# Altium project 2011_BatteryMaster.PrjPcb
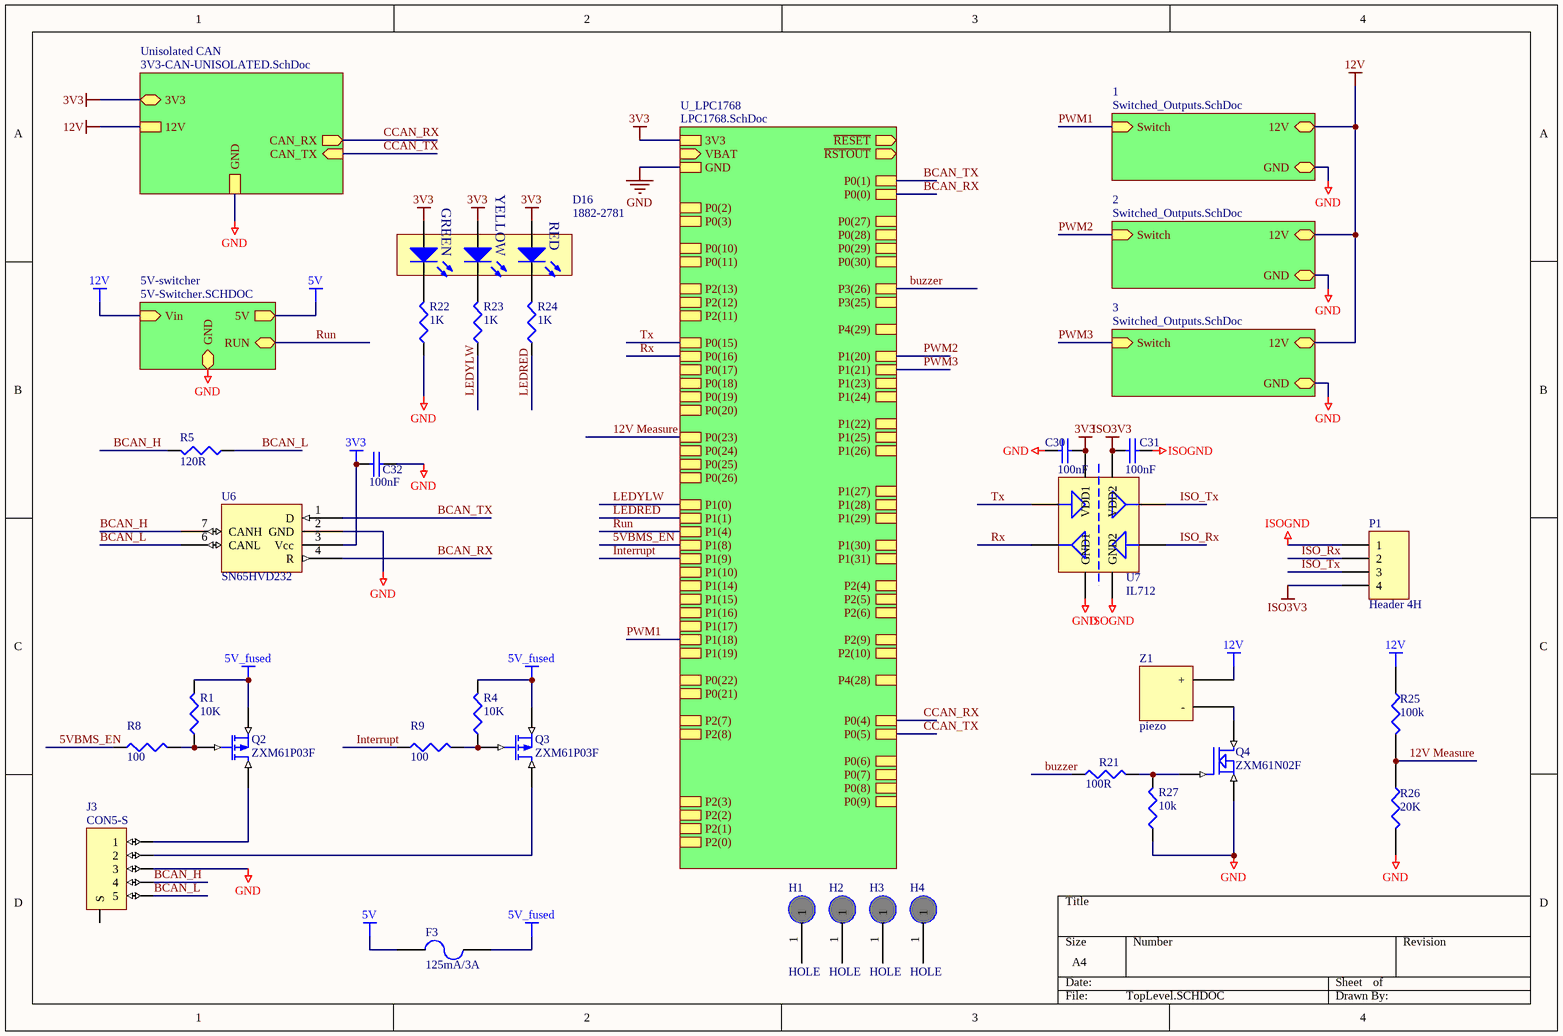
[diagram p0: TopLevel.SCHDOC]
5 sheets, 76 parts. Net scope: hierarchical (ports join the sheet entries above them; power ports are global).
Board files: BMSFaceplate.PcbDoc, CANFaceplate.PcbDoc, BatteryMaster.PcbDoc
Sheets:
  TopLevel.SCHDOC
    Unisolated CAN = 3V3-CAN-UNISOLATED.SchDoc
      U_3V-Switcher-50mA = 3V-Switcher-50mA.SCHDOC
    1 = Switched_Outputs.SchDoc
    2 = Switched_Outputs.SchDoc
    3 = Switched_Outputs.SchDoc
    5V-switcher = 5V-Switcher.SchDoc

## Sheet TopLevel.SCHDOC
size A4

### Parts
C30  100nF  [0603]
C31  100nF  [0603]
C32  100nF  [0603]
D16  1882-2781  [LED_TRILEVEL]
F3  125mA/3A  [LITTELFUSE-154]
H1  HOLE  [M2.5]
H2  HOLE  [M2.5]
H3  HOLE  [M2.5]
H4  HOLE  [M2.5]
J3  CON5-S  [TRIAD5F]
P1  Header 4H  [HDR1X4H]
Q2  ZXM61P03F  [SOT23-3]
Q3  ZXM61P03F  [SOT23-3]
Q4  ZXM61N02F  [SOT23-3]
R1  10K  [0603]
R4  10K  [0603]
R5  120R  [0603]
R8  100  [0603]
R9  100  [0603]
R21  100R  [0603]
R22  1K  [0603]
R23  1K  [0603]
R24  1K  [0603]
R25  100k  [1206]
R26  20K  [1206]
R27  10k  [0603]
U6  SN65HVD232  [SO8]
U7  IL712  [SO8]
Z1  piezo  [piezo]

### Sub-sheets
1 = Switched_Outputs.SchDoc: Switch (in), 12V, GND
2 = Switched_Outputs.SchDoc: Switch (in), 12V, GND
3 = Switched_Outputs.SchDoc: Switch (in), 12V, GND
5V-switcher = 5V-Switcher.SCHDOC: GND, 5V, Vin, RUN
U_LPC1768 = LPC1768.SchDoc (file not in this document): P0(26), P0(25), P0(24), P0(23), P1(31), P1(30), P0(28), P0(27), P3(26), P3(25), P0(29), P0(30), P1(18), P1(19), P1(20), P1(21), P1(22), P1(24), P1(23), P1(25), P1(26), P1(27), P1(28), P1(29), P0(0), P0(1), P0(10), P0(11), P2(13), P2(12), P2(11), P2(10), P0(22), P0(21), P0(20), P0(19), P0(18), P0(17), P0(15), P0(16), P2(9), P2(8), P2(7), P2(6), P2(5), P2(4), P2(3), P2(2), P2(1), P2(0), P0(2), P0(3), P1(0), P1(1), P1(4), P1(8), P1(9), P1(10), P1(14), P1(15), P1(16), P1(17), P0(4), P0(5), P0(6), P0(7), P0(8), P0(9), P4(29), P4(28), GND, 3V3, ~{RSTOUT}, ~{RESET}, VBAT (in)
Unisolated CAN = 3V3-CAN-UNISOLATED.SchDoc: 12V, GND, 3V3, CAN_RX (out), CAN_TX (in)

### Nets
3V3: C30.2 C32.2 D16.4(A) D16.5(A) D16.6(A) U6.3(Vcc) U7.1(VDD1) ; sheet Unisolated CAN/3V3, sheet U_LPC1768/3V3
5V: F3.2 ; sheet 5V-switcher/5V
5V_fused: F3.1 Q2.2(D) Q3.2(D) R1.2 R4.2
12V: R25.1 Z1.1(+) ; sheet Unisolated CAN/12V, sheet 1/12V, sheet 2/12V, sheet 3/12V, sheet 5V-switcher/Vin
GND: C30.1 C32.1 J3.3 Q4.2(S) R22.1 R26.2 R27.1 U6.2(GND) U7.4(GND1) ; sheet Unisolated CAN/GND, sheet 1/GND, sheet 2/GND, sheet U_LPC1768/GND, sheet 3/GND, sheet 5V-switcher/GND  [project net CANGND]
ISO3V3: C31.1 P1.4 U7.8(VDD2)
ISOGND: C31.2 P1.1 U7.5(GND2)
5VBMS_EN: R8.1 ; sheet U_LPC1768/P1(8)
12V Measure: R25.2 R26.1 ; sheet U_LPC1768/P0(23)
BCAN_H: J3.4 R5.2 U6.7(CANH)
BCAN_L: J3.5 R5.1 U6.6(CANL)
BCAN_RX: U6.4(R) ; sheet U_LPC1768/P0(0)
BCAN_TX: U6.1(D) ; sheet U_LPC1768/P0(1)
buzzer: R21.1 ; sheet U_LPC1768/P3(26)
CCAN_RX: sheet Unisolated CAN/CAN_RX, sheet U_LPC1768/P0(4)
CCAN_TX: sheet Unisolated CAN/CAN_TX, sheet U_LPC1768/P0(5)
Interrupt: R9.1 ; sheet U_LPC1768/P1(9)
ISO_Rx: P1.2 U7.6(IN2)
ISO_Tx: P1.3 U7.7(OUT1)
LEDRED: R24.1 ; sheet U_LPC1768/P1(1)
LEDYLW: R23.1 ; sheet U_LPC1768/P1(0)
PWM1: sheet 1/Switch, sheet U_LPC1768/P1(18)
PWM2: sheet 2/Switch, sheet U_LPC1768/P1(20)
PWM3: sheet U_LPC1768/P1(21), sheet 3/Switch
Run: sheet U_LPC1768/P1(4), sheet 5V-switcher/RUN
Rx: U7.3(OUT2) ; sheet U_LPC1768/P0(16)
Tx: U7.2(IN1) ; sheet U_LPC1768/P0(15)
NetD16_1: D16.1(K) R22.2
NetD16_2: D16.2(K) R23.2
NetD16_3: D16.3(K) R24.2
NetJ3_1: J3.1 Q2.3(S)
NetJ3_2: J3.2 Q3.3(S)
NetQ2_1: Q2.1(G) R1.1 R8.2
NetQ3_1: Q3.1(G) R4.1 R9.2
NetQ4_1: Q4.1(G) R21.2 R27.2
NetQ4_3: Q4.3(D) Z1.2(-)

Not connected (* = marked no-connect by the designer): H1 1; H2 1; H3 1; H4 1; J3 0(S)

### Library data of the parts
C30-C32 = CAP: Capacitor; Farnell: 753-567; Price: 0.31
D16 = LED-TRILEVEL: Three level LED; Element14 (low stock): 1461596; Element14 Price: 4.56; Digikey: 350-1751-ND; Digikey Price: 2.84
F3 = FUSE2: Fuse; Farnell: 664-893; Other Info: www.littelfuse.com; Price: 5.67
J3 = CON5-S: Connector, 2 pin, with shield @ S; Farnell: .131-040; Price: 19.32
P1 = Header 4H: Header, 4-Pin, Right Angle; LatestRevisionDate: 17-Jul-2002; LatestRevisionNote: Re-released for DXP Platform.; Publisher: Altium Limited
Q2 Q3 = ZXM61P03F: 1.1A, 30V P-Channel Enhancement mode FET; Order#: 9525300; Price: 0.825; Supplier: Farnell
Q4 = ZXM61N02F: 1.7A, 20V N-Channel Enhancement mode FET; Farnell: 325-6194; Price: 0.75
R1 R4 R5 R8 R9 R22-R24 = RES1: Resistor; Farnell: *
R21 R25-R27 = RES1
  R21 R27: Farnell: 911-112; Price: 0.119
  R25: Farnell: 308-6422; Price: 1.010
  R26: Farnell: 308-6252; Price: 1.010
U6 = SN65HVD232: 3.3V CAN Transciever; Farnell: NA
U7 = IL712: IL712 Optical Isolator; Element14 (low stock): 9570608; Element14 Price: 9.40; Digikey: 390-1061-5-ND; Digikey Price: 5.86

## Sheet 3V3-CAN-UNISOLATED.SchDoc
size A4; Organization: UNSW Solar Racing Team; Address3: UNSW; Address4: Sydney NSW 2052; Address2: Electrical Engineering; Address1: Rm 109
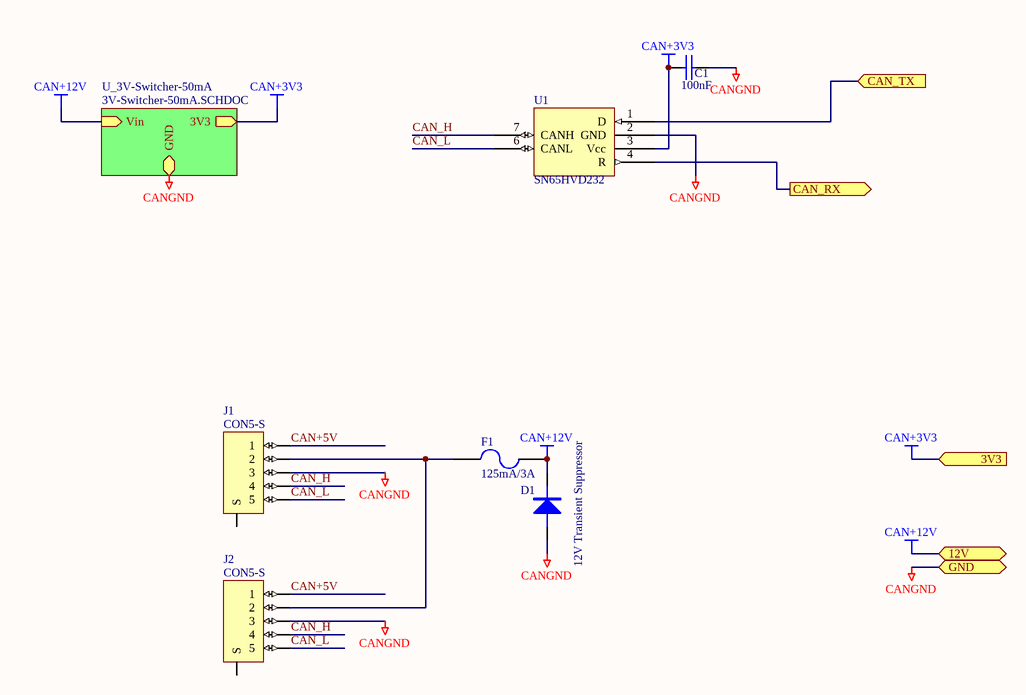
[diagram p1: 3V3-CAN-UNISOLATED.SchDoc]

### Parts
C1  100nF  [0603]
D1  12V Transient Suppressor  [SMA]
F1  125mA/3A  [LITTELFUSE-154]
J1  CON5-S  [TRIAD5F]
J2  CON5-S  [TRIAD5F]
U1  SN65HVD232  [SO8]

### Sub-sheets
U_3V-Switcher-50mA = 3V-Switcher-50mA.SCHDOC: GND, 3V3, Vin

### Ports
3V3, 12V, CAN_RX (out), CAN_TX (in), GND

### Nets
CAN+3V3: C1.2 U1.3(Vcc) ; port 3V3, sheet U_3V-Switcher-50mA/3V3  [project net 3V3]
CAN+12V: D1.K F1.2 ; port 12V, sheet U_3V-Switcher-50mA/Vin  [project net 12V]
CANGND: C1.1 D1.A J1.3 J2.3 U1.2(GND) ; port GND, sheet U_3V-Switcher-50mA/GND
CAN+5V: J1.1 J2.1
CAN_H: J1.4 J2.4 U1.7(CANH)
CAN_L: J1.5 J2.5 U1.6(CANL)
CCAN_RX: U1.4(R) ; port CAN_RX
CCAN_TX: U1.1(D) ; port CAN_TX
NetF1_1: F1.1 J1.2 J2.2

Not connected (* = marked no-connect by the designer): J1 0(S); J2 0(S)

### Notes on the sheet
- Title
- Size:
- Date:
- A4
- Number:
- Time:
- Revision:
- Sheet
- of
- File:

### Library data of the parts
C1 = CAP: Capacitor; Farnell: 753-567; Price: 0.31
D1 = DIODE: Farnell: 302-3096; Price: 1.25
F1 = FUSE2: Fuse; Farnell: 664-893; Other Info: www.littelfuse.com; Price: 5.67
J1 J2 = CON5-S: Connector, 2 pin, with shield @ S; Farnell: .131-040; Price: 19.32
U1 = SN65HVD232: 3.3V CAN Transciever; Farnell: NA

## Sheet 3V-Switcher-50mA.SCHDOC
size A4; Organization: UNSW Solar Racing Team; Address3: UNSW; Address4: Sydney NSW 2052; Address2: Electrical Engineering; Address1: Rm 109
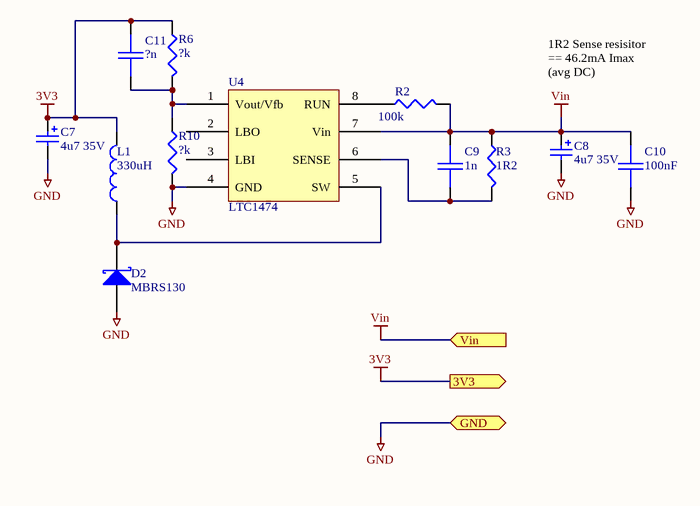
[diagram p2: 3V-Switcher-50mA.SCHDOC]

### Parts
C7  4u7 35V  [MCCT-CASEC]
C8  4u7 35V  [MCCT-CASEC]
C9  1n  [0603]
C10  100nF  [0603]
C11  ?n  [0603]
D2  MBRS130  [SMB]
L1  330uH  [1812]
R2  100k  [0603]
R3  1R2  [0603]
R6  value ?k  [0603]  (hidden comment: 100k)
R10  value ?k  [0603]  (hidden comment: 100k)
U4  LTC1474  [SO8]

### Ports
3V3, GND, Vin (in)

### Nets
3V3: C7.1 C11.1 L1.2 R6.1 ; port 3V3
GND: C7.2 C8.2 C10.2 D2.A R10.2 U4.4(GND) ; port GND  [project net CANGND]
Vin: C8.1 C9.1 C10.1 R2.2 R3.1 U4.7(Vin) ; port Vin  [project net 12V]
NetC9_2: C9.2 R3.2 U4.6(SENSE)
NetC11_2: C11.2 R6.2 R10.1 U4.1(Vout/Vfb)
NetD2_K: D2.K L1.1 U4.5(SW)
NetR2_1: R2.1 U4.8(RUN)

Not connected (* = marked no-connect by the designer): U4 2(LBO) 3(LBI)

### Notes on the sheet
- 1R2 Sense resisitor == 46.2mA Imax (avg DC)
- Title
- Size:
- Date:
- A4
- Number:
- Time:
- Revision:
- Sheet
- of
- File:

### Library data of the parts
C7 C8 = Cap Pol3: Polarized Capacitor (Surface Mount); Value: 4.7uF; Revision: July-2002: Re-released for DXP Platform.; Farnell: 967-294; Price: 1.97
C9 C11 = CAP: Capacitor; Value: 1nF; Revision: July-2002: Re-released for DXP Platform.; Farnell: 317-202; Price: 0.15
C10 = CAP: Capacitor; Value: 0.1uF; Revision: July-2002: Re-released for DXP Platform.; Farnell: 753-567; Price: 0.31
D2 = D SCHOTTKY: Schottky Diode; Revision: July-2002: Re-released for DXP Platform.; Farnell: 708-150; Price: 1.49
L1 = Inductor: Revision: July-2002: Re-released for DXP Platform.; Value: 330uH; Farnell: 200-451; Price: 2.90
R2 R6 R10 = RES1: Resistor; Farnell: 612-728; Price: 0.13
  R2: Value: 100k
R3 = RES1: Resistor; Value: 1.2R; Revision: July-2002: Re-released for DXP Platform.; Farnell: 360-2229; Price: 0.15
U4 = LTC1474: Step-down converter; Farnell: NA

## Sheet Switched_Outputs.SchDoc: 4 Port Switch Card Top Level
size A4; Date: June 2003; CheckedBy: Bonne Eggleston; Author: Johanna May; Organization: UNSW Solar Racing Team; Address3: UNSW; Address4: Sydney NSW 2052; SheetNumber: 1; SheetTotal: 2; Address2: Electrical Engineering; Address1: Rm 109
Used 3 times, as channels 1, 2, 3. Parts and nets are listed once, with the designators drawn on the sheet.
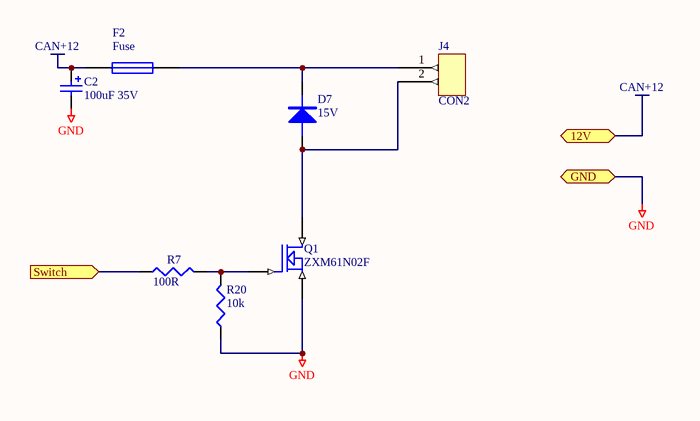
[diagram p3: Switched_Outputs.SchDoc]

### Parts
C2  100uF 35V  [MCCT-CASED]
D7  15V  [SMB]
F2  Fuse  [LITTELFUSE-154]
J4  CON2  [MICROFIT-2]
Q1  ZXM61N02F  [SOT23(3)]
R7  100R  [0603]
R20  10k  [0603]

### Ports
12V (bidir), GND (bidir), Switch (in)

### Nets
CAN+12: C2.1 F2.1 ; port 12V
GND: C2.2 Q1.2(S) R20.1 ; port GND
Switch: R7.1 ; port Switch
NetD7_A: D7.A J4.2 Q1.3(D)
NetD7_K: D7.K F2.2 J4.1
NetQ1_1: Q1.1(G) R7.2 R20.2

### Channels
1: designators end in _1; ports 12V=12V GND=CANGND Switch=PWM1
2: designators end in _2; ports 12V=12V GND=CANGND Switch=PWM2
3: designators end in _3; ports 12V=12V GND=CANGND Switch=PWM3

### Notes on the sheet
- Title
- Size:
- Date:
- A4
- Number:
- Time:
- Revision:
- Sheet
- of
- File:

### Library data of the parts
C2 = Cap Pol3: as C7 on sheet 3V-Switcher-50mA; Revision: July-2002: Re-released for DXP Platform.; Farnell: 967-294; Price: 1.97
D7 = DIODE: Farnell: 302-3096; Price: 1.25
J4 = CON2: Connector; Farnell: 673-031; Price: 2.67
Q1 = ZXM61N02F: 1.7A, 20V N-Channel Enhancement mode FET; Farnell: 325-6194; Price: 0.75
R7 R20 = RES1: Farnell: 911-112; Price: 0.119
F2 = FUSE: Farnell: 664-960; Price: 5.26

## Sheet 5V-Switcher.SchDoc
size A
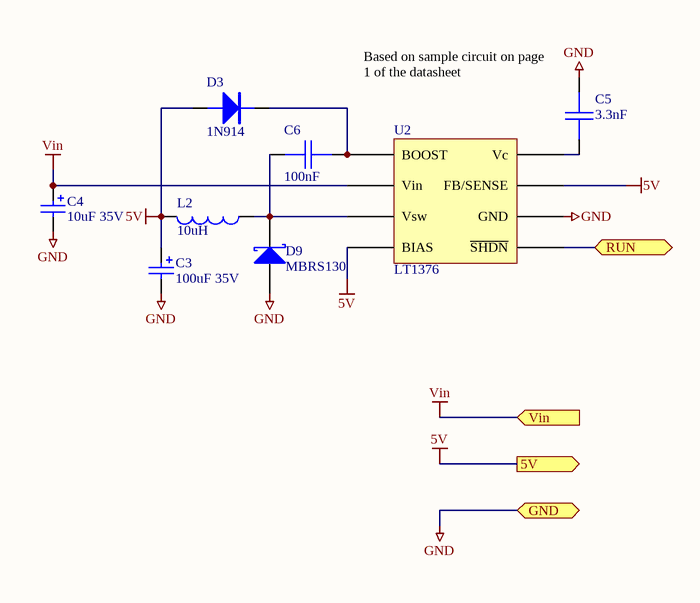
[diagram p4: 5V-Switcher.SchDoc]

### Parts
C3  100uF 35V  [MCCT-CASEC]
C4  10uF 35V  [MCCT-CASEC]
C5  3.3nF  [0603]
C6  100nF  [0603]
D3  1N914  [SMB]
D9  MBRS130  [SMB]
L2  10uH  [1812]
U2  LT1376  [SO8]

### Ports
5V, GND, RUN, Vin (in)

### Nets
5V: C3.1 D3.A L2.2 U2.4(BIAS) U2.7(FB/SENSE) ; port 5V
GND: C3.2 C4.2 C5.1 D9.A U2.6(GND) ; port GND  [project net CANGND]
Vin: C4.1 U2.2(Vin) ; port Vin  [project net 12V]
Run: U2.5(~{SHDN}) ; port RUN
NetC5_2: C5.2 U2.8(Vc)
NetC6_1: C6.1 D9.K L2.1 U2.3(Vsw)
NetC6_2: C6.2 D3.K U2.1(BOOST)

### Notes on the sheet
- Based on sample circuit on page 1 of the datasheet

### Library data of the parts
C3 C4 = Cap Pol3: as C7 on sheet 3V-Switcher-50mA; Revision: July-2002: Re-released for DXP Platform.; Farnell: 967-294; Price: 1.97
C5 = CAP: Capacitor; Value: 1nF; Revision: July-2002: Re-released for DXP Platform.; Farnell: 317-202; Price: 0.15
C6 = CAP: Capacitor; Value: 0.1uF; Revision: July-2002: Re-released for DXP Platform.; Farnell: 753-567; Price: 0.31
D3 = DIODE: Farnell: 302-3096; Price: 1.25
D9 = D SCHOTTKY: Schottky Diode; Revision: July-2002: Re-released for DXP Platform.; Farnell: 708-150; Price: 1.49
L2 = Inductor: Value: 330uH; Revision: July-2002: Re-released for DXP Platform.; Farnell: 200-451; Price: 2.90

## Nets that join several sheets
3V3: TopLevel (7 pins), 3V3-CAN-UNISOLATED (C1.2 U1.3), 3V-Switcher-50mA (C7.1 C11.1 L1.2 R6.1)
5V: TopLevel (F3.2), 5V-Switcher (5 pins)
12V: TopLevel (R25.1 Z1.1), 3V3-CAN-UNISOLATED (D1.K F1.2), 3V-Switcher-50mA (6 pins), 1 (C2_1.1 F2_1.1), 2 (C2_2.1 F2_2.1), 3 (C2_3.1 F2_3.1), 5V-Switcher (C4.1 U2.2)
CANGND: TopLevel (9 pins), 3V3-CAN-UNISOLATED (5 pins), 3V-Switcher-50mA (6 pins), 1 (C2_1.2 Q1_1.2 R20_1.1), 2 (C2_2.2 Q1_2.2 R20_2.1), 3 (C2_3.2 Q1_3.2 R20_3.1), 5V-Switcher (5 pins)